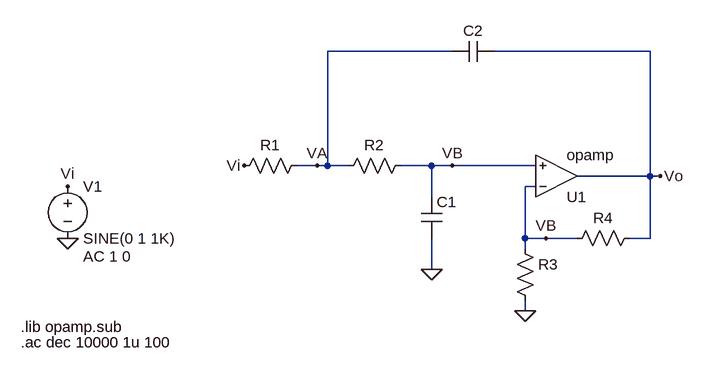
[diagram p0: schematic sallenkey_sinvalores.asc]
sallenkey_sinvalores.asc, the LTspice schematic file:
Version 4.1
SHEET 1 880 680
WIRE 320 -16 128 -16
WIRE 624 -16 384 -16
WIRE 112 160 80 160
WIRE 128 160 128 -16
WIRE 128 160 112 160
WIRE 160 160 128 160
WIRE 288 160 240 160
WIRE 320 160 288 160
WIRE 448 160 320 160
WIRE 624 176 624 -16
WIRE 624 176 512 176
WIRE 640 176 624 176
WIRE 448 192 432 192
WIRE 288 208 288 160
WIRE 432 272 432 192
WIRE 464 272 432 272
WIRE 512 272 464 272
WIRE 624 272 624 176
WIRE 624 272 592 272
WIRE 432 288 432 272
WIRE 288 320 288 272
WIRE 432 384 432 368
FLAG 288 320 0
FLAG 432 384 0
FLAG 640 176 Vo
FLAG 0 160 Vi
FLAG -272 192 Vi
FLAG -272 272 0
FLAG 112 160 VA
FLAG 320 160 VB
FLAG 464 272 VB
SYMBOL res 96 144 R90
WINDOW 0 0 56 VBottom 2
WINDOW 3 32 56 VTop 2
SYMATTR InstName R1
SYMATTR Value ""
SYMBOL res 256 144 R90
WINDOW 0 0 56 VBottom 2
WINDOW 3 32 56 VTop 2
SYMATTR InstName R2
SYMATTR Value ""
SYMBOL cap 272 208 R0
SYMATTR InstName C1
SYMATTR Value ""
SYMBOL cap 384 -32 R90
WINDOW 0 0 32 VBottom 2
WINDOW 3 32 32 VTop 2
SYMATTR InstName C2
SYMATTR Value ""
SYMBOL res 416 272 R0
SYMATTR InstName R3
SYMATTR Value ""
SYMBOL res 608 256 R90
WINDOW 0 0 56 VBottom 2
WINDOW 3 32 56 VTop 2
SYMATTR InstName R4
SYMATTR Value ""
SYMBOL OpAmps\\opamp 480 240 M180
SYMATTR InstName U1
SYMBOL voltage -272 176 R0
WINDOW 123 24 124 Left 2
WINDOW 39 0 0 Left 0
SYMATTR Value2 AC 1 0
SYMATTR InstName V1
SYMATTR Value SINE(0 1 1K)
TEXT -344 408 Left 2 !.lib opamp.sub
TEXT -344 432 Left 2 !.ac dec 10000 1u 100

The netlist it stands for:
* sallenkey_sinvalores.asc
R1 VA Vi
R2 VB VA
C1 VB 0
C2 Vo VA
R3 VB 0
R4 Vo VB
X§U1 VB VB Vo opamp Aol=100K GBW=10Meg  ; pins invin noninvin out
V1 Vi 0 SINE(0 1 1K) AC 1 0
.lib opamp.sub
.ac dec 10000 1u 100
.backanno
.end